# Altium project bogo_board.PrjPcb (part 4 of 4)

## Sheet 08_Programming_Reset.SchDoc: Programming/Reset/User IO
size A; Revision: A; SheetNumber: 8; SheetTotal: 10; ECE315_Project_Name: ECE453 Processor Mezzanine
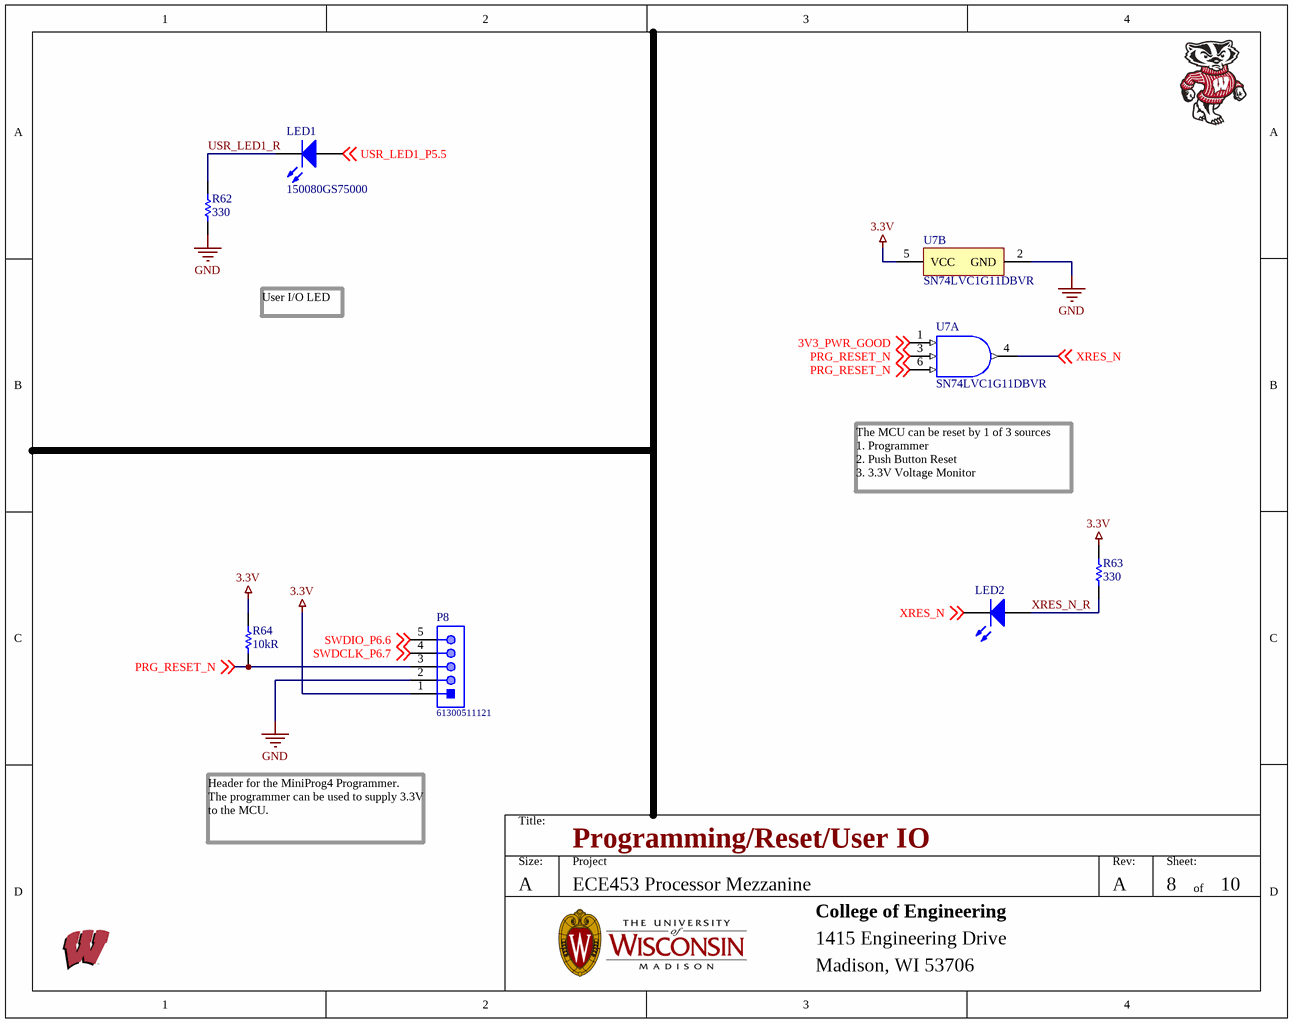
[diagram p7: 08_Programming_Reset.SchDoc]

### Parts
LED1  150080GS75000  [0805_A]
LED2  150080RS75000  [0805_A]  (value not drawn)
P8  61300511121  [61300511121]
R62  Resistance: 330  [RESC2013X60X35LL10T20]  (hidden comment: RC0805FR-07330RL)
R63  Resistance: 330  [RESC2013X60X35LL10T20]  (hidden comment: RC0805FR-07330RL)
R64  Resistance: 10kR  [RESC2013X60X35NL10T20]  (hidden comment: RC0805FR-0710KL)
U7  SN74LVC1G11DBVR  [DBV0006A_N]  (parts A,B of 2)

### Nets
3.3V: P8.1 R63.2 R64.2 U7.5(VCC)
GND: P8.2 R62.1 U7.2(GND)
3V3_PWR_GOOD: U7.1(A) ; off-sheet 3V3_PWR_GOOD
PRG_RESET_N: P8.3 R64.1 U7.3(B) U7.6(C) ; off-sheet PRG_RESET_N
SWDCLK_P6.7: P8.4 ; off-sheet SWDCLK_P6.7
SWDIO_P6.6: P8.5 ; off-sheet SWDIO_P6.6
USR_LED1_P5.5: LED1.2(A) ; off-sheet USR_LED1_P5.5
USR_LED1_R: LED1.1(K) R62.2
XRES_N: LED2.1(K) U7.4(Y) ; off-sheet XRES_N
XRES_N_R: LED2.2(A) R63.1

### Notes on the sheet
- User I/O LED
- The MCU can be reset by 1 of 3 sources
  1. Programmer
  2. Push Button Reset
  3. 3.3V Voltage Monitor
- Header for the MiniProg4 Programmer.  The programmer can be used to supply 3.3V to the MCU.
- Title:
- Size:
- A
- Project
- Rev:
- Sheet:
- of
- College of Engineering
- 1415 Engineering Drive
- Madison, WI 53706

### Library data of the parts
LED1 = CMP-1426-00007-1: SMD mono-color Chip LED, WL-SMCW, Green; Manufacturer: Wuerth Elektronik; Manufacturer 1: Wurth Electronics; Viewing Angle: 140°; Lens Style: Clear,Rectangular; Luminous Intensity: 450mcd; Forward Voltage: 3.2V; Wavelength: 520nm; Forward Current: 30mA; Test Current: 20mA; Lens Color: Colorless; Lens Transparency: Clear; Lens Size: 1.25mm; PackageReference: 0805_A; Color: Green; PartNumber: 150080GS75000; ComponentLink2URL: http://katalog.we-online.com/led/datasheet/150080GS75000.pdf; ComponentLink1URL: http://www.we-online.com; ComponentLink1Description: Manufacturer URL; ComponentLink2Description: Datasheet; Supplier 1: Digi-Key; Supplier Part Number 1: 732-4983-1-ND; Manufacturer Part Number 1: 150080GS75000; RoHS: Yes; Category: LEDs; Stock 1: 95801; Pricing 1: 1=0.19000, 50=0.17600, 100=0.15100, 500=0.13100 (USD); Mount: Surface Mount; Case/Package: 0805; Case Code (Metric): 2012; Case Code (Imperial): 0805; Min Operating Temperature: -40°C; Max Operating Temperature: 85°C; Package Quantity: 4000; Packaging: Cut Tape; Dominant Wavelength: 520nm; Length: 2mm; Width: 1.25mm; Height: 0.7mm; REACH SVHC: Unknown; RoHS Compliant: Yes; ComponentLink3URL: https://datasheet.ciiva.com/29563/150080gs75000-29563008.pdf?src-supplier=Digi-Key; ComponentLink3Description: https://datasheet.ciiva.com/29563/150080gs75000-29563008.pdf?src-supplier=Digi-Key; ComponentLink4URL: https://datasheet.ciiva.com/29279/759434-da-01-en-chipled-0805-w-kl-gruen-150080gs75000-29279039.pdf?src-supplier=Conrad; ComponentLink4Description: https://datasheet.ciiva.com/29279/759434-da-01-en-chipled-0805-w-kl-gruen-150080gs75000-29279039.pdf?src-supplier=Conrad; Supplier: Newark; Supplier Part Number: 95W3800; Manufacturer Part Number: 150080GS75000; Stock: 59977; Pricing: 1=0.194, 5=0.194, 10=0.191, 25=0.186, 50=0.18, 100=0.154, 500=0.141 (USD); Mounting Technology: Surface Mount; Series: WL-SMCW; Reach SVHC Compliant: Unknown
LED2 = CMP-1426-00011-1: SMD mono-color Chip LED, WL-SMCW, Red; Manufacturer: Wuerth Elektronik; Manufacturer 1: Wurth Electronics; Luminous Intensity: 150mcd; Viewing Angle: 140°; Forward Voltage: 2V; Lens Style: Clear,Rectangular; Forward Current: 30mA; Dominant Wavelength: 625nm; Test Current: 20mA; Lens Color: Colorless; Lens Transparency: Clear; Lens Size: 1.25mm; Color: Red; PartNumber: 150080RS75000; PackageReference: 0805_A; ComponentLink2Description: Datasheet; ComponentLink1URL: http://www.we-online.com; ComponentLink1Description: Manufacturer URL; ComponentLink2URL: http://katalog.we-online.com/led/datasheet/150080RS75000.pdf; Supplier 1: Digi-Key; Supplier Part Number 1: 732-4984-1-ND; Manufacturer Part Number 1: 150080RS75000; RoHS: Yes; Category: LEDs; Stock 1: 100282; Pricing 1: 1=0.19000, 50=0.17600, 100=0.15100, 500=0.13100 (USD); Mount: Surface Mount; Case/Package: 0805; Case Code (Metric): 2012; Case Code (Imperial): 0805; Min Operating Temperature: -40°C; Max Operating Temperature: 85°C; Packaging: Tape and Reel; Wavelength: 625nm; Package Quantity: 4000; Length: 2mm; Width: 1.25mm; Height: 0.7mm; RoHS Compliant: Yes; REACH SVHC: Unknown; ComponentLink3URL: https://datasheet.ciiva.com/22656/150080rs75000-22656961.pdf?src-supplier=Element14; ComponentLink3Description: https://datasheet.ciiva.com/22656/150080rs75000-22656961.pdf?src-supplier=Element14; ComponentLink4URL: https://datasheet.ciiva.com/29279/759435-da-01-en-chipled-0805-w-kl-rot-150080rs75000-29279032.pdf?src-supplier=Conrad; ComponentLink4Description: https://datasheet.ciiva.com/29279/759435-da-01-en-chipled-0805-w-kl-rot-150080rs75000-29279032.pdf?src-supplier=Conrad; Supplier: Newark; Supplier Part Number: 95W3801; Manufacturer Part Number: 150080RS75000; Stock: 14062; Pricing: 1=0.194, 5=0.194, 10=0.191, 25=0.186, 50=0.18, 100=0.154 (USD); Mounting Technology: Surface Mount; Series: WL-SMCW; Reach SVHC Compliant: Unknown
P8 = CMP-1502-01068-1: THT Vertical Pin Header WR-PHD, Pitch 2.54 mm, Single Row, 5 pins; Manufacturer: Wurth Elektronik; Manufacturer 1: Wurth Electronics; Pin Number: 5; Contact Resistance: 20mOhm; Working Voltage: 250VAC; Pitch: 2.54mm; Withstanding Voltage: 500VAC; Rated Current: 3A; Gender: Male; Connector Type: Male Pin; Datasheet URL: https://katalog.we-online.de/em/datasheet/6130xx11121.pdf; Orientation: Vertical; Mounting Technology: THT; Row Number: Single; Package Reference: 61300511121; Publisher: WurthElektronik; Part Number: 61300511121; Packaging: Bag; Manufacturer URL: http://www.we-online.de; Operating Temperature: -40to105degC; Supplier 1: Digi-Key; Supplier Part Number 1: 732-5318-ND; Manufacturer Part Number 1: 61300511121; RoHS: Yes; Category: Headers and Wire Housings; Stock 1: 41302; Pricing 1: 1=0.26000, 10=0.22200, 25=0.18520, 50=0.15500, 100=0.14100, 1000=0.12800 (USD); Mount: Through Hole; Contact Plating: Gold; Contact Material: Copper; Color: Black; Number of Rows: 1; Termination: Solder; Number of Contacts: 5; Number of Positions: 5; Contact Mating Length: 0.236inch; RoHS Compliant: Yes; REACH SVHC: Unknown; Lead Free: Lead Free; ComponentLink1URL: http://www.farnell.com/cad/1737268.pdf?src-supplier=Element14; ComponentLink1Description: http://www.farnell.com/cad/1737268.pdf?src-supplier=Element14; ComponentLink2URL: https://katalog.we-online.de/em/datasheet/6130xx11121.pdf?src-supplier=Digi-Key; ComponentLink2Description: https://katalog.we-online.de/em/datasheet/6130xx11121.pdf?src-supplier=Digi-Key; Supplier: Newark; Supplier Part Number: 20X0955; Manufacturer Part Number: 61300511121; Stock: 4184; Pricing: 1=0.265, 10=0.226, 25=0.189, 50=0.158, 100=0.144 (USD); Series: WR-PHD; Contact Type: Male Pin; Reach SVHC Compliant: Unknown
R62 R63 = CMP-2000-06960-1: Chip Resistor, 330 Ohm, +/- 1%, 125 mW, -55 to 155 degC, 0805 (2012 Metric), RoHS, Tape and Reel; Manufacturer: Yageo; Manufacturer Part Number: CRCW0805330RFKEA; Voltage Rating: 150V; Temperature Coefficient: 100PPM/C; Power Rating: 125mW(1/8W); Max Power Dissipation: 125mW; Value: 330R; Datasheet Version: Rev. 7, 05/2017; Termination Style: SMD/SMT; Case Code - mm: 2012; Package Description: 2-Pin Surface Mounted Device, Body 2 x 1.25 mm; Operating Temperature Range: -55Cto+155C; Case Code - in: 0805; Packaging: Reel; Tolerance: 1%; Package Reference: 0805; Mounting Technology: SurfaceMount; Product: ThickFilmResistorsGeneralPurpose; Series: RC; Manufacturer URL: http://www.yageo.com/; Datasheet URL: http://www.yageo.com/documents/recent/PYu-RC_Group_51_RoHS_L_7.pdf; Supplier 1: Digi-Key; Supplier Part Number 1: 311-330CRCT-ND; Manufacturer 1: Yageo; Manufacturer Part Number 1: RC0805FR-07330RL; RoHS: Yes; Category: Chip SMD Resistors; Stock 1: 1297787; Pricing 1: 1=0.10000, 10=0.03700, 100=0.01510, 1000=0.00680, 2500=0.00590 (USD); Case/Package: 0805; Case Code (Imperial): 0805; Case Code (Metric): 2012; Size Code: 0805; Min Operating Temperature: -55°C; Max Operating Temperature: 155°C; Package Quantity: 5000; Termination: SMD/SMT; Construction: Rectangular; Resistor Type: Thick Film; Number of Terminations: 2; Features: Moisture Resistant; Resistance Tolerance: 1%; Length: 0.079inch; Width: 0.049inch; Height: 0.024inch; Depth: 1.25mm; RoHS Compliant: Yes; Military Standard: Not; Lead Free: Lead Free; ComponentLink1URL: https://datasheet.ciiva.com/2457/pyu-r-int-thick-7-2457015.pdf?src-supplier=Digi-Key; ComponentLink1Description: https://datasheet.ciiva.com/2457/pyu-r-int-thick-7-2457015.pdf?src-supplier=Digi-Key; ComponentLink2URL: https://datasheet.ciiva.com/2457/pyu-r-int-thick-7-2457016.pdf?src-supplier=Digi-Key; ComponentLink2Description: https://datasheet.ciiva.com/2457/pyu-r-int-thick-7-2457016.pdf?src-supplier=Digi-Key; ComponentLink3URL: https://datasheet.ciiva.com/2457/pyu-r-int-thick-7-2457014.pdf?src-supplier=Digi-Key; ComponentLink3Description: https://datasheet.ciiva.com/2457/pyu-r-int-thick-7-2457014.pdf?src-supplier=Digi-Key; ComponentLink4URL: https://datasheet.ciiva.com/12667/rc0805-12667925.pdf?src-supplier=Mouser; ComponentLink4Description: https://datasheet.ciiva.com/12667/rc0805-12667925.pdf?src-supplier=Mouser; ComponentLink5URL: https://datasheet.ciiva.com/7941/444164-7941768.pdf?src-supplier=Element14; ComponentLink5Description: https://datasheet.ciiva.com/7941/444164-7941768.pdf?src-supplier=Element14; ComponentLink6URL: https://datasheet.ciiva.com/7941/444164-7941769.pdf?src-supplier=Element14; ComponentLink6Description: https://datasheet.ciiva.com/7941/444164-7941769.pdf?src-supplier=Element14; ComponentLink7URL: https://datasheet.ciiva.com/16740/rc0805-16740975.pdf?src-supplier=Future+Electronics; ComponentLink7Description: https://datasheet.ciiva.com/16740/rc0805-16740975.pdf?src-supplier=Future+Electronics; Supplier: Newark; Supplier Part Number: 53K0164; Stock: 218356; Pricing: 1=0.02, 25=0.02, 50=0.02, 100=0.02 (USD); Contact Plating: Tin; Weight: 0.000194oz; Voltage Rating (DC): 150V; Ratings: AEC-Q200; Reach SVHC Compliant: Unknown; ComponentLink8URL: https://datasheet.ciiva.com/8944/dcrcwe3-8944773.pdf?src-supplier=Avnet; ComponentLink8Description: https://datasheet.ciiva.com/8944/dcrcwe3-8944773.pdf?src-supplier=Avnet; ComponentLink9URL: https://datasheet.ciiva.com/8944/dcrcwe3-8944776.pdf?src-supplier=Avnet; ComponentLink9Description: https://datasheet.ciiva.com/8944/dcrcwe3-8944776.pdf?src-supplier=Avnet; ComponentLink10URL: https://datasheet.ciiva.com/7777/1697337-7777390.pdf?src-supplier=Element14; ComponentLink10Description: https://datasheet.ciiva.com/7777/1697337-7777390.pdf?src-supplier=Element14; ComponentLink11URL: https://datasheet.ciiva.com/16769/70201119-16769852.pdf?src-supplier=Allied+Electronics; ComponentLink11Description: https://datasheet.ciiva.com/16769/70201119-16769852.pdf?src-supplier=Allied+Electronics
R64 = CMP-1659-00013-4: Chip Resistor, 10 KOhm, +/- 1%, 0.125 W, -55 to 155 degC, 0805 (2012 Metric), RoHS, Tape and Reel; Manufacturer: Yageo; Voltage Rating: 150 V; Temperature Coefficient: 100ppm/°C; Power Rating: 125mW; Value: 10kR; Mount: Surface Mount; ComponentLink1Description: Manufacturer URL; ComponentLink2URL: http://www.yageo.com/documents/recent/PYu-RC_Group_51_RoHS_L_04.pdf; Pins: 2; Length: 2 mm; Min Operating Temperature: -55 degC; Height: 0.5 mm; Mounting Technology: Surface Mount; RoHSCompliant: true; REACH SVHC: No SVHC; ComponentLink1URL: http://www.yageo.com/; Max Operating Temperature: 155 degC; PackageReference: 0805; DatasheetVersion: Rev. 4, 02/2016; Package Quantity: 5000; Packaging: Tape and Reel; ComponentLink2Description: Datasheet; PackageDescription: 2-Pin Surface Mounted Device, Body 2 x 1.25 mm; Supplier 1: Digi-Key; Supplier Part Number 1: 311-10.0KCRCT-ND; Manufacturer 1: Yageo; Manufacturer Part Number 1: RC0805FR-0710KL; RoHS: Yes; Category: Chip SMD Resistors; Stock 1: 5682818; Pricing 1: 1=0.10000, 10=0.03800, 100=0.01560, 1000=0.00702, 2500=0.00610 (USD); Case/Package: 0805; Case Code (Imperial): 0805; Case Code (Metric): 2012; Size Code: 0805; Tolerance: 1%; Resistor Type: Thick Film; Series: RC; Number of Terminations: 2; Max Power Dissipation: 125mW; Termination: SMD/SMT; Features: Moisture Resistant; Construction: Rectangular; Resistance Tolerance: 1%; Technology: THICK FILM; Width: 0.049inch; Depth: 1.25mm; RoHS Compliant: Yes; Military Standard: Not; Lead Free: Lead Free; ComponentLink3URL: https://datasheet.ciiva.com/11808/0900766b8106beab-11808151.pdf?src-supplier=RSComponents; ComponentLink3Description: https://datasheet.ciiva.com/11808/0900766b8106beab-11808151.pdf?src-supplier=RSComponents; ComponentLink4URL: https://datasheet.ciiva.com/46447/444164-46447563.pdf?src-supplier=Element14; ComponentLink4Description: https://datasheet.ciiva.com/46447/444164-46447563.pdf?src-supplier=Element14; ComponentLink5URL: https://datasheet.ciiva.com/2456/pyu-r-int-thick-7-2456973.pdf?src-supplier=Digi-Key; ComponentLink5Description: https://datasheet.ciiva.com/2456/pyu-r-int-thick-7-2456973.pdf?src-supplier=Digi-Key; ComponentLink6URL: https://datasheet.ciiva.com/2456/pyu-r-int-thick-7-2456974.pdf?src-supplier=Digi-Key; ComponentLink6Description: https://datasheet.ciiva.com/2456/pyu-r-int-thick-7-2456974.pdf?src-supplier=Digi-Key; ComponentLink7URL: https://datasheet.ciiva.com/2456/pyu-r-int-thick-7-2456972.pdf?src-supplier=Digi-Key; ComponentLink7Description: https://datasheet.ciiva.com/2456/pyu-r-int-thick-7-2456972.pdf?src-supplier=Digi-Key; ComponentLink8URL: https://datasheet.ciiva.com/12669/rc0805-12669688.pdf?src-supplier=Mouser; ComponentLink8Description: https://datasheet.ciiva.com/12669/rc0805-12669688.pdf?src-supplier=Mouser; ComponentLink9URL: https://datasheet.ciiva.com/16747/rc0805-16747087.pdf?src-supplier=Future+Electronics; ComponentLink9Description: https://datasheet.ciiva.com/16747/rc0805-16747087.pdf?src-supplier=Future+Electronics; Supplier: Newark; Supplier Part Number: 05M4535; Manufacturer Part Number: RC0805FR-0710KL; Stock: 346650; Pricing: 1=0.102, 10=0.035, 25=0.028, 50=0.021, 100=0.014 (USD); Reach SVHC Compliant: Unknown; ComponentLink10URL: https://datasheet.ciiva.com/11808/0900766b8106beab-11808151.pdf?src-supplier=Rs; ComponentLink10Description: https://datasheet.ciiva.com/11808/0900766b8106beab-11808151.pdf?src-supplier=Rs
U7 = CMP-0859-00236-3: Single 3-Input Positive-AND Gate, DBV0006A, LARGE T&R; Manufacturer: Texas Instruments; Output Type: CMOS; Voltage(Nom)(V): 1.8,2.5,3.3,5; ICC @ Nom Voltage(Max)(mA): 0.01; VCC(Min)(V): 1.65; Output Drive (IOL/IOH)(Max)(mA): 32/-32; Schmitt Trigger: No; Input Type: CMOS/TTL; VCC(Max)(V): 5.5; Gate Type: AND; Rating: Catalog; tpd @ Nom Voltage(Max)(ns): 20,7.8,6.2,4.6; Bits(#): 1; F @ Nom Voltage(Max)(Mhz): 150; Logic: True; Technology Family: LVC; Number of Inputs: 3; Propagation Delay: 3.5ns; Min Supply Voltage: 1.65V; Max Supply Voltage: 5.5V; Quiescent Current: 10uA; High Level Output Current: -32mA; Low Level Output Current: 32mA; Turn-On Delay Time: 4.9ns; Sub-Family: AND Gate; PackageReference: DBV0006A; Operating Temperature Range(C): -40 to 125,-40 to 85; DatasheetVersion: SCES487F; 3-State Output: No; Generic Part Number: SN74LVC1G11; Supplier: Newark; Supplier Part Number: 29AH7598; Manufacturer Part Number: SN74LVC1G11DBVR; RoHS: Yes; Category: Logic Gates; Pricing: 1=0.398, 5=0.398, 10=0.326, 25=0.298, 50=0.26, 100=0.221, 250=0.211, 500=0.206, 1000=0.203 (USD); Mounting Technology: Surface Mount; Case/Package: SOT-23; Pins: 6; Weight: 0.000229oz; Min Operating Temperature: -40°C; Max Operating Temperature: 125°C; Packaging: Tape and Reel; Logic Function: AND GATE; Number of Outputs: 1; Number of Elements: 1; Number of Circuits: 1; Number of Input Lines: 3; Number of Output Lines: 1; Number of Bits: 1; Series: 74LVC; Technology: CMOS; Number of Gates: 1; Termination: SMD/SMT; Max Output current: 32mA; Output Current: 32mA; Radiation Hardening: No; Lead Free: Lead Free; RoHS Compliant: Yes; Reach SVHC Compliant: No; ComponentLink1URL: https://datasheet.ciiva.com/1864/sn74lvc1g11-1864480.pdf?src-supplier=Digi-Key; ComponentLink1Description: https://datasheet.ciiva.com/1864/sn74lvc1g11-1864480.pdf?src-supplier=Digi-Key; ComponentLink2URL: https://datasheet.ciiva.com/6124/1775276-6124474.pdf?src-supplier=Farnell; ComponentLink2Description: https://datasheet.ciiva.com/6124/1775276-6124474.pdf?src-supplier=Farnell; ComponentLink3URL: https://datasheet.ciiva.com/1864/sn74lvc1g11-1864479.pdf?src-supplier=Digi-Key; ComponentLink3Description: https://datasheet.ciiva.com/1864/sn74lvc1g11-1864479.pdf?src-supplier=Digi-Key; ComponentLink4URL: https://datasheet.ciiva.com/1864/sn74lvc1g11-1864481.pdf?src-supplier=Digi-Key; ComponentLink4Description: https://datasheet.ciiva.com/1864/sn74lvc1g11-1864481.pdf?src-supplier=Digi-Key; ComponentLink5URL: https://datasheet.ciiva.com/14290/sn74lvc1g11-14290741.pdf?src-supplier=Avnet; ComponentLink5Description: https://datasheet.ciiva.com/14290/sn74lvc1g11-14290741.pdf?src-supplier=Avnet; ComponentLink6URL: https://datasheet.ciiva.com/46384/1882071-46384382.pdf?src-supplier=Element14; ComponentLink6Description: https://datasheet.ciiva.com/46384/1882071-46384382.pdf?src-supplier=Element14; ComponentLink7URL: https://datasheet.ciiva.com/7783/1775276-7783594.pdf?src-supplier=Element14; ComponentLink7Description: https://datasheet.ciiva.com/7783/1775276-7783594.pdf?src-supplier=Element14; ComponentLink8URL: https://datasheet.ciiva.com/7783/1775276-7783595.pdf?src-supplier=Element14; ComponentLink8Description: https://datasheet.ciiva.com/7783/1775276-7783595.pdf?src-supplier=Element14

## Sheet 06_Servo_Motor_ICs.SchDoc: Servo Motor ICs
size A; Revision: A; SheetNumber: 6; SheetTotal: 10; ECE315_Project_Name: ECE453 F23 Base Project
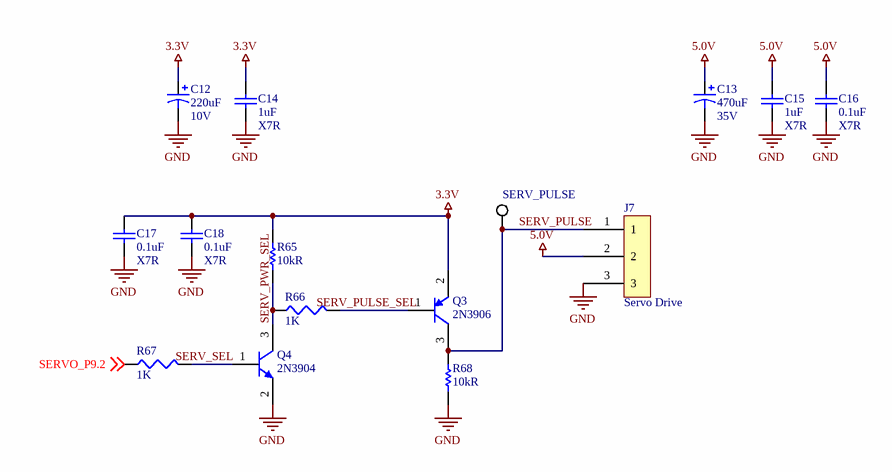
[diagram p8: 06_Servo_Motor_ICs.SchDoc]

### Parts
C12  Voltage: 10V  [CAPPR2-5x11]  (hidden comment: 220uF)
C13  Voltage: 35V  [CAPPR5-10x12.5]  (hidden comment: 470uF)
C14  Dielectric: X7R  [CAP_0805]  (hidden comment: 1uF)
C15  Dielectric: X7R  [CAP_0805]  (hidden comment: 1uF)
C16  Dielectric: X7R  [CAP_0805]  (hidden comment: 0.1uF)
C17  Dielectric: X7R  [CAP_0805]  (hidden comment: 0.1uF)
C18  Dielectric: X7R  [CAP_0805]  (hidden comment: 0.1uF)
J7  Servo Drive  [3X1HDR]
Q3  2N3906  [SOT23-3M]
Q4  2N3904  [SOT23-3M]
R65  Resistance: 10kR  [RESC2013X60X35NL10T20]  (hidden comment: RC0805FR-0710KL)
R66  value 1K  [RES_0805]  (hidden comment: 10K)
R67  value 1K  [RES_0805]  (hidden comment: 10K)
R68  Resistance: 10kR  [RESC2013X60X35NL10T20]  (hidden comment: RC0805FR-0710KL)
SERV_PULSE  (no value)  [KSTN-5019_V]

### Nets
3.3V: C12.1 C14.2 C17.1 C18.2 Q3.2(E) R65.2
5.0V: C13.1 C15.2 C16.2 J7.2
GND: C12.2 C13.2 C14.1 C15.1 C16.1 C17.2 C18.1 J7.3 Q4.2(E) R68.1
SERV_PULSE: J7.1 Q3.3(C) R68.2 SERV_PULSE.1
SERV_PULSE_SEL: Q3.1(B) R66.2
SERV_PWR_SEL: Q4.3(C) R65.1 R66.1
SERV_SEL: Q4.1(B) R67.2
SERVO_P9.2: R67.1 ; off-sheet SERVO_P9.2

### Notes on the sheet
- Title:
- Size:
- A
- Project
- Rev:
- Sheet:
- of
- College of Engineering
- 1415 Engineering Drive
- Madison, WI 53706

### Library data of the parts
C12 = Cap Pol1_1: Capacitor Al 105deg 220uF 10V 5X11; Manufacturer: Rubycon; Manufacturer Part Number: 10YXJ220M5X11; Tolerance: 20%; Ripple Current: 250mA; Impedance: 400mR; Leakage Current: 3uA; Life (Hours): 4000Hour; Lead Diameter: 0.5mm; Value: 220uF; Supplier: Digi-Key; Supplier Part Number: 1189-4150-ND; RoHS: Yes; Category: Aluminum Electrolytic Capacitors; Stock 1: 94; Pricing 1: 1=0.26000, 10=0.17500, 50=0.11680, 100=0.09930, 500=0.07010, 1000=0.06134, 2500=0.05842, 5000=0.05404 (USD); Mount: Through Hole; Case/Package: Radial; Min Operating Temperature: -40°C; Max Operating Temperature: 105°C; Capacitance: 220uF; Termination: Radial; Package Quantity: 3000; Packaging: Bulk; Voltage Rating: 10V; Series: YXJ; Construction: RADIAL; Diameter: 5mm; Height: 11mm; Lead Pitch: 2mm; Height - Seated (Max): 0.492inch; Radiation Hardening: No; RoHS Compliant: Yes; ComponentLink1URL: https://datasheet.ciiva.com/11777/0900766b810307a1-11777018.pdf?src-supplier=RSComponents; ComponentLink1Description: https://datasheet.ciiva.com/11777/0900766b810307a1-11777018.pdf?src-supplier=RSComponents; ComponentLink2URL: https://datasheet.ciiva.com/6318/e-yxj-6318863.pdf?src-supplier=Digi-Key; ComponentLink2Description: https://datasheet.ciiva.com/6318/e-yxj-6318863.pdf?src-supplier=Digi-Key; ComponentLink3URL: https://datasheet.ciiva.com/11690/e-yxj-11690699.pdf?src-supplier=Avnet; ComponentLink3Description: https://datasheet.ciiva.com/11690/e-yxj-11690699.pdf?src-supplier=Avnet
C13 = Cap Pol3_1: CAP ALUM 470UF 20% 35V RADIAL; Manufacturer: Rubycon; Manufacturer Part Number: 35ZL470MEFC10X20; Leakage Current: 3uA; Lead Diameter: 0.6mm; Dielectric Material: Aluminium; Life (Hours): 4000Hour; Ripple Current: 1.82A; Impedance: 23mR; Value: 470uF; Case/Package: Radial; Max Operating Temperature: 105°C; REACH SVHC: Unknown; Min Operating Temperature: -40°C; Supplier Part Number: 35ZL470MEFC10X20-ND; Packaging: Bulk; Lead Pitch: 5mm; Diameter: 10mm; Capacitance: 470uF; Lead Free: Lead Free; Radiation Hardening: No; Package Quantity: 1000; Height: 20mm; Voltage Rating: 35V; Mount: Through Hole; Supplier: Digi-Key; Height - Seated (Max): 0.866inch; Tolerance: 20%; Termination: Radial
C14 C15 = Cap_5: CAP CER 1UF 50V X7R 0805; Manufacturer: Samsung; Manufacturer Part Number: CL21B105KBFNNNE; Tolerance: 10%; Dielectric Material: Ceramic; Value: 1uF; Case Code (Metric): 2012; Min Operating Temperature: -55°C; Mount: Surface Mount; Width: 0.049inch; Voltage Rating (DC): 50V; Voltage Rating: 50V; Height: 1.25mm; Case Code (Imperial): 0805; Supplier: Digi-Key; Supplier Part Number: 1276-1029-6-ND; Capacitance: 1uF; Case/Package: 0805; Construction: Flat; Max Operating Temperature: 125°C; REACH SVHC: No SVHC; Voltage: 50V; Packaging: Tape and Reel; Depth: 1.25mm; Package Quantity: 1; Radiation Hardening: No; Series: CL; Length: 2mm; Thickness: 0.053inch; Termination: SMD/SMT; Number of Pins: 2; RoHS Compliant: Yes
C16-C18 = Cap_1: Cap Ceramic 0.1uF 50V X7R 20% SMD 0805 125°C Plastic T/R; Manufacturer: KEMET; Manufacturer Part Number: C0805C104M5RAC7210; Supplier: Digi-Key; Supplier Part Number: 399-C0805C104M5RAC7210CT-ND; RoHS: Yes; Category: Ceramic Capacitors; Stock 1: 29705; Pricing 1: 1=0.10000, 10=0.05900, 50=0.03220, 100=0.02620, 500=0.01874, 1000=0.01472, 2500=0.01338, 5000=0.01231 (USD); Mounting Technology: Surface Mount; Case/Package: 0805; Dielectric Material: Ceramic; Min Operating Temperature: -55°C; Max Operating Temperature: 125°C; Packaging: Tape and Reel; Tolerance: 20%; Voltage Rating (DC): 50V; Construction: Flat; Length: 2mm; Height: 0.9mm; Depth: 1.25mm; Radiation Hardening: No; RoHS Compliant: Yes; ComponentLink1URL: https://datasheet.ciiva.com/26923/getdatasheetpartid-738954-26923963.pdf?src-supplier=Verical; ComponentLink1Description: https://datasheet.ciiva.com/26923/getdatasheetpartid-738954-26923963.pdf?src-supplier=Verical; Value: 0.1uF
J7 = 3-Pin_1: Switch Slide N.O./N.C. SPDT Top Slide 0.2A 30VDC PC Pins Thru-Hole; Manufacturer: E-Switch; Manufacturer Part Number: EG1218; Voltage Rating (DC): 30V; Electrical Life: 10000Cycles; Switch Travel: 2.5mm; Switch Function: On-On; Actuator Type: Standard; Contact Current Rating: 200mA; Operating Force: 250gf; Illumination Type: Non-Illuminated; Number of Positions: 2; Insulation Resistance: 100R; Contact Resistance: 20mR; Actuator Length: 2mm; Supplier 1: Digi-Key; Supplier Part Number 1: EG1903-ND; RoHS: Yes; Category: Slide Switches; Stock 1: 46638; Pricing 1: 1=0.74, 25=0.6664, 100=0.5958, 500=0.5047, 2500=0.42434 (USD); Mounting Technology: Through Hole; Pins: 3; Contact Material: Copper Alloy,Copper,Silver; Contact Plating: Silver; Min Operating Temperature: -20°C; Max Operating Temperature: 70°C; Throw Configuration: SPDT; Termination: PC Pin; Packaging: Bulk; Orientation: Straight; Series: EG; Voltage Rating (AC): 30V; Voltage Rating: 30V; Lead Free: Lead Free; RoHS Compliant: Yes; Reach SVHC Compliant: No; ComponentLink1URL: https://datasheet.ciiva.com/1699/p040040c-1699451.pdf?src-supplier=Newark; ComponentLink1Description: https://datasheet.ciiva.com/1699/p040040c-1699451.pdf?src-supplier=Newark
Q3 = 2N3906: TRANS PNP 40V 0.2A SOT23; Manufacturer Part Number: MMBT3906LT1G; Manufacturer: ON Semiconductor; Current - Collector (Ic) (Max): 200mA; Vce Saturation (Max) @ Ib, Ic: 400mV @ 5mA, 50mA; DC Current Gain (hFE) (Min) @ Ic, Vce: 100 @ 10mA, 1V; Power - Max: 300mW; Frequency - Transition: 250MHz; Transistor Type: PNP; Category: Discrete Semiconductor Products; RoHS: RoHS Compliant; Supplier: Digi-Key; Supplier Part Number: MMBT3906LT1GOSCT-ND; Packaging: Cut Tape (CT); Voltage - Collector Emitter Breakdown (Max): 40V; Mounting Type: Surface Mount; Supplier Device Package: SOT-23-3 (TO-236); Package / Case: TO-236-3, SC-59, SOT-23-3; Value: 2N3906
Q4 = 2N3904: NPN General Purpose Amplifier; Manufacturer Part Number: MMBT3904-7-F; Manufacturer: Diodes Incorporated; Frequency - Transition: 300MHz; Power - Max: 300mW; DC Current Gain (hFE) (Min) @ Ic, Vce: 100 @ 10mA, 1V; Current - Collector Cutoff (Max): 50nA (ICBO); Vce Saturation (Max) @ Ib, Ic: 300mV @ 5mA, 50mA; Voltage - Collector Emitter Breakdown (Max): 40V; Current - Collector (Ic) (Max): 200mA; Supplier Device Package: SOT-23-3; Mounting Type: Surface Mount; Transistor Type: NPN; Packaging: Cut Tape (CT); RoHS: RoHS Compliant; Package / Case: TO-236-3, SC-59, SOT-23-3; Supplier Part Number: MMBT3904-FDICT-ND; Supplier: Digi-Key; Category: Discrete Semiconductor Products; Value: 2N3904
R65 R68 = CMP-1659-00013-4: as R64 on sheet 08_Programming_Reset; Mount: Surface Mount; ComponentLink1Description: Manufacturer URL; ComponentLink2URL: http://www.yageo.com/documents/recent/PYu-RC_Group_51_RoHS_L_04.pdf; Pins: 2; Length: 2 mm; Min Operating Temperature: -55 degC; Height: 0.5 mm; Mounting Technology: Surface Mount; RoHSCompliant: true; REACH SVHC: No SVHC; ComponentLink1URL: http://www.yageo.com/; Max Operating Temperature: 155 degC; PackageReference: 0805; DatasheetVersion: Rev. 4, 02/2016; Package Quantity: 5000; Packaging: Tape and Reel; ComponentLink2Description: Datasheet; PackageDescription: 2-Pin Surface Mounted Device, Body 2 x 1.25 mm; Supplier 1: Digi-Key; Supplier Part Number 1: 311-10.0KCRCT-ND; Manufacturer 1: Yageo; Manufacturer Part Number 1: RC0805FR-0710KL; RoHS: Yes; Category: Chip SMD Resistors; Stock 1: 5682818; Pricing 1: 1=0.10000, 10=0.03800, 100=0.01560, 1000=0.00702, 2500=0.00610 (USD); Case/Package: 0805; Case Code (Imperial): 0805; Case Code (Metric): 2012; Size Code: 0805; Tolerance: 1%; Resistor Type: Thick Film; Series: RC; Number of Terminations: 2; Max Power Dissipation: 125mW; Termination: SMD/SMT; Features: Moisture Resistant; Construction: Rectangular; Resistance Tolerance: 1%; Technology: THICK FILM; Width: 0.049inch; Depth: 1.25mm; RoHS Compliant: Yes; Military Standard: Not; Lead Free: Lead Free; ComponentLink3URL: https://datasheet.ciiva.com/11808/0900766b8106beab-11808151.pdf?src-supplier=RSComponents; ComponentLink3Description: https://datasheet.ciiva.com/11808/0900766b8106beab-11808151.pdf?src-supplier=RSComponents; ComponentLink4URL: https://datasheet.ciiva.com/46447/444164-46447563.pdf?src-supplier=Element14; ComponentLink4Description: https://datasheet.ciiva.com/46447/444164-46447563.pdf?src-supplier=Element14; ComponentLink5URL: https://datasheet.ciiva.com/2456/pyu-r-int-thick-7-2456973.pdf?src-supplier=Digi-Key; ComponentLink5Description: https://datasheet.ciiva.com/2456/pyu-r-int-thick-7-2456973.pdf?src-supplier=Digi-Key; ComponentLink6URL: https://datasheet.ciiva.com/2456/pyu-r-int-thick-7-2456974.pdf?src-supplier=Digi-Key; ComponentLink6Description: https://datasheet.ciiva.com/2456/pyu-r-int-thick-7-2456974.pdf?src-supplier=Digi-Key; ComponentLink7URL: https://datasheet.ciiva.com/2456/pyu-r-int-thick-7-2456972.pdf?src-supplier=Digi-Key; ComponentLink7Description: https://datasheet.ciiva.com/2456/pyu-r-int-thick-7-2456972.pdf?src-supplier=Digi-Key; ComponentLink8URL: https://datasheet.ciiva.com/12669/rc0805-12669688.pdf?src-supplier=Mouser; ComponentLink8Description: https://datasheet.ciiva.com/12669/rc0805-12669688.pdf?src-supplier=Mouser; ComponentLink9URL: https://datasheet.ciiva.com/16747/rc0805-16747087.pdf?src-supplier=Future+Electronics; ComponentLink9Description: https://datasheet.ciiva.com/16747/rc0805-16747087.pdf?src-supplier=Future+Electronics; Supplier: Newark; Supplier Part Number: 05M4535; Manufacturer Part Number: RC0805FR-0710KL; Stock: 346650; Pricing: 1=0.102, 10=0.035, 25=0.028, 50=0.021, 100=0.014 (USD); Reach SVHC Compliant: Unknown; ComponentLink10URL: https://datasheet.ciiva.com/11808/0900766b8106beab-11808151.pdf?src-supplier=Rs; ComponentLink10Description: https://datasheet.ciiva.com/11808/0900766b8106beab-11808151.pdf?src-supplier=Rs
R66 R67 = Res3_1: Res Thick Film 0805 1K Ohm 1% 0.125W(1/8W) ±100ppm/C Pad SMD Automotive T/R; Manufacturer: Stackpole Electronics; Manufacturer Part Number: RMCF0805FT1K00; Power Rating: 125mW; Temperature Coefficient: 100ppm/°C; Supplier 1: Digi-Key; Supplier Part Number 1: RMCF0805FT1K00CT-ND; RoHS: Yes; Category: Chip SMD Resistors; Stock 1: 2773085; Pricing 1: 1=0.10000, 10=0.02400, 100=0.00970, 1000=0.00437, 2500=0.00379 (USD); Mounting Technology: Surface Mount; Case/Package: 0805; Case Code (Metric): 2012; Case Code (Imperial): 0805; Contact Plating: Tin,Matte; Min Operating Temperature: -55°C; Max Operating Temperature: 155°C; Tolerance: 1%; Packaging: Tape and Reel; Resistor Type: Thick Film; Number of Terminations: 2; Max Power Dissipation: 125mW; Features: Automotive AEC-Q200; Series: RMCF; Construction: Rectangular; Length: 2mm; Width: 0.049inch; Height: 0.026inch; Depth: 1.25mm; Radiation Hardening: No; Military Standard: Not; Lead Free: Lead Free; RoHS Compliant: Yes; ComponentLink1URL: https://datasheet.ciiva.com/15193/getdatasheetpartid-360136-15193546.pdf?src-supplier=Verical; ComponentLink1Description: https://datasheet.ciiva.com/15193/getdatasheetpartid-360136-15193546.pdf?src-supplier=Verical
SERV_PULSE = CMP-1672-00008-1: Test Point, 1 Position SMD, RoHS, Tape and Reel; Manufacturer: Keystone Electronics; Manufacturer Part Number: 5019; Plating: Silver; Body Material: Bronze; Supplier: Newark; Supplier Part Number: 59Y8500; RoHS: Yes; Category: Connectors; Stock: 11269; Pricing: 1=0.411, 10=0.389, 25=0.285, 50=0.279, 100=0.273, 250=0.246 (USD); Mounting Technology: Surface Mount,PCB; Pins: 1; Contact Plating: Silver; Contact Material: Bronze; Material: Bronze; Packaging: Tape and Reel; Package Quantity: 1; Termination: SMD/SMT; Series: 5019; Height: 0.09inch; Reach SVHC Compliant: No; RoHS Compliant: Yes; Lead Free: Lead Free; ComponentLink1URL: https://datasheet.ciiva.com/14848/m60-2p61-14848437.pdf?src-supplier=Digi-Key; ComponentLink1Description: https://datasheet.ciiva.com/14848/m60-2p61-14848437.pdf?src-supplier=Digi-Key; ComponentLink2URL: https://datasheet.ciiva.com/14848/m60-2p61-14848438.pdf?src-supplier=Digi-Key; ComponentLink2Description: https://datasheet.ciiva.com/14848/m60-2p61-14848438.pdf?src-supplier=Digi-Key; ComponentLink3URL: https://datasheet.ciiva.com/14848/m60-2p61-14848439.pdf?src-supplier=Digi-Key; ComponentLink3Description: https://datasheet.ciiva.com/14848/m60-2p61-14848439.pdf?src-supplier=Digi-Key; ComponentLink4URL: https://datasheet.ciiva.com/16318/m60-2p61-16318395.pdf?src-supplier=Future+Electronics; ComponentLink4Description: https://datasheet.ciiva.com/16318/m60-2p61-16318395.pdf?src-supplier=Future+Electronics; ComponentLink5URL: https://datasheet.ciiva.com/16885/70182998-16885945.pdf?src-supplier=Allied+Electronics; ComponentLink5Description: https://datasheet.ciiva.com/16885/70182998-16885945.pdf?src-supplier=Allied+Electronics

## Sheet 09_USB_Bridge.SchDoc: USB Bridge
size A; Revision: A; SheetNumber: 9; SheetTotal: 10; ECE315_Project_Name: ECE453 Processor Mezzanine
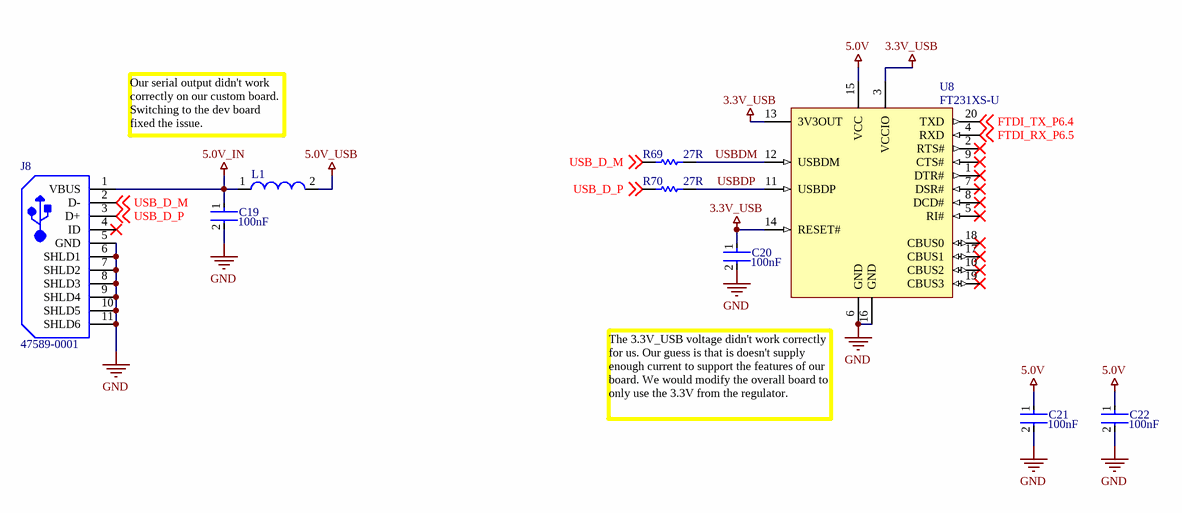
[diagram p9: 09_USB_Bridge.SchDoc]

### Parts
C19  value 100nF  [FP-C0805C-DN-MFG]  (hidden comment: C0805C104K5RACTU)
C20  value 100nF  [FP-C0805C-DN-MFG]  (hidden comment: C0805C104K5RACTU)
C21  value 100nF  [FP-C0805C-DN-MFG]  (hidden comment: C0805C104K5RACTU)
C22  value 100nF  [FP-C0805C-DN-MFG]  (hidden comment: C0805C104K5RACTU)
J8  47589-0001  [MOLX-47589-0001_V]
L1  742792093  [SMD-0805]  (value not drawn)
R69  value 27R  [RESC2013X70X40ML20T20]  (hidden comment: ERJ6ENF27R0V)
R70  value 27R  [RESC2013X70X40ML20T20]  (hidden comment: ERJ6ENF27R0V)
U8  FT231XS-U  [SSOP-20_L]

### Nets
3.3V_USB: C20.1 U8.3(VCCIO) U8.13(3V3OUT) U8.14(RESET#)
5.0V: C21.1 C22.1 U8.15(VCC)
5.0V_IN: C19.1 J8.1(VBUS) L1.1
5.0V_USB: L1.2
GND: C19.2 C20.2 C21.2 C22.2 J8.5(GND) J8.6(SHLD1) J8.7(SHLD2) J8.8(SHLD3) J8.9(SHLD4) J8.10(SHLD5) J8.11(SHLD6) U8.6(GND) U8.16(GND)
FTDI_RX_P6.5: U8.4(RXD) ; off-sheet FTDI_RX_P6.5
FTDI_TX_P6.4: U8.20(TXD) ; off-sheet FTDI_TX_P6.4
USB_D_M: J8.2(D-) R69.1 ; off-sheet USB_D_M
USB_D_P: J8.3(D+) R70.1 ; off-sheet USB_D_P
USBDM: R69.2 U8.12(USBDM)
USBDP: R70.2 U8.11(USBDP)

Not connected (* = marked no-connect by the designer): J8 4(ID)*; U8 1(DTR#)* 2(RTS#)* 5(RI#)* 7(DSR#)* 8(DCD#)* 9(CTS#)* 10(CBUS2)* 17(CBUS1)* 18(CBUS0)* 19(CBUS3)*

### Notes on the sheet
- Our serial output didn't work correctly on our custom board. Switching to the dev board fixed the issue.
- (near U8) The 3.3V_USB voltage didn't work correctly for us. Our guess is that is doesn't supply enough current to support the features of our board. We would modify the overall board to only use the 3.3V from the regulator.
- Title:
- Size:
- A
- Project
- Rev:
- Sheet:
- of
- College of Engineering
- 1415 Engineering Drive
- Madison, WI 53706

### Library data of the parts
C19-C22 = CMP-2007-00279-2: CAP CER 0.1UF 50V X7R 0805; Manufacturer: KEMET; Tolerance: 10%; Voltage: 500V; ComponentLink2Description: Datasheet; ComponentLink2URL: https://content.kemet.com/datasheets/KEM_C1003_C0G_SMD.pdf; Supplier: Newark; Supplier Part Number: 19C6015; Manufacturer Part Number: C0805C104K5RACTU; RoHS: Yes; Category: Ceramic Capacitors; Stock: 3382390; Pricing: 1=0.024, 25=0.024, 50=0.024, 100=0.024, 250=0.024, 500=0.024, 1000=0.024 (USD); Mounting Technology: Surface Mount,PCB; Case/Package: 0805; Pins: 2; Case Code (Imperial): 0805; Case Code (Metric): 2012; Min Operating Temperature: -55°C; Max Operating Temperature: 125°C; Package Quantity: 4000; Voltage Rating: 50V; Packaging: Tape and Reel; Voltage Rating (DC): 50V; Dielectric: X7R; Termination: SMD/SMT; Series: SMD Comm X7R; Construction: Flat; Length: 2mm; Width: 1.2mm; Height: 0.9mm; Lead Pitch: 0.75mm; Depth: 1.25mm; Radiation Hardening: No; RoHS Compliant: Yes; Reach SVHC Compliant: No; ComponentLink1URL: https://datasheet.ciiva.com/32431/slceramic-chip-condensers-e-32431755.pdf?src-supplier=Distrelec; ComponentLink1Description: https://datasheet.ciiva.com/32431/slceramic-chip-condensers-e-32431755.pdf?src-supplier=Distrelec; ComponentLink3URL: https://datasheet.ciiva.com/28682/1851736-28682232.pdf?src-supplier=Element14; ComponentLink3Description: https://datasheet.ciiva.com/28682/1851736-28682232.pdf?src-supplier=Element14
J8 = CMP-2000-05610-1: Right Angle Female Type AB Micro USB Connector, 30 V, 1.8 A, -30 to 85 degC, RoHS, Tape and Reel; Manufacturer: Molex; Voltage Rating: 30V; Contact Resistance: 40mR; Current Rating: 1.8A; Max Voltage Rating (AC): 100V; Connector Type: USB,Receptacle; Number of Ports: 1; Number of Contacts: 5; USB Standard: USB 2.0; Pitch: 0.65mm; Supplier: Newark; Supplier Part Number: 40P3749; Manufacturer Part Number: 47589-0001; RoHS: Yes; Category: USB Connectors; Stock: 10404; Pricing: 1=0.536, 25=0.536, 100=0.492, 250=0.492, 500=0.492, 1000=0.492 (USD); Mounting Technology: Surface Mount,PCB; Contact Plating: Gold; Contact Material: Copper Alloy,Copper; Color: Black; Housing Material: Polymer; Min Operating Temperature: -20°C; Max Operating Temperature: 85°C; Packaging: Tape and Reel; Termination: Solder; Series: 47589; Voltage Rating (AC): 30V; Gender: Female; Orientation: Right Angle; Length: 8.65mm; Radiation Hardening: No; RoHS Compliant: Yes; Reach SVHC Compliant: Unknown; ComponentLink1URL: https://datasheet.ciiva.com/1098/1597783-1098478.pdf?src-supplier=Element14; ComponentLink1Description: https://datasheet.ciiva.com/1098/1597783-1098478.pdf?src-supplier=Element14; ComponentLink2URL: https://datasheet.ciiva.com/11731/0900766b80dfe0a8-11731295.pdf?src-supplier=Rs; ComponentLink2Description: https://datasheet.ciiva.com/11731/0900766b80dfe0a8-11731295.pdf?src-supplier=Rs
L1 = CMP-0220-00169-1: SMD EMI Suppression Ferrite Bead WE-CBF, Z = 2200 Ohm; Manufacturer: Wurth Electronics; Current Rating: 200mA; Tolerance: 25%; Number of Lines: 1; DC Resistance (DCR): 600mR; Test Frequency: 100MHz; Value: 3.9nH; Shielding: Unshielded; DatasheetVersion: Dec-2005; ComponentLink2URL: http://www.we-online.de/katalog/media/pdf/742792093.pdf; PackageDescription: Chip Inductor, 2-Leads, Body 2.0 x 1.2 mm; Impedance: 2200 Ohm; ComponentLink2Description: Datasheet; ComponentLink1Description: Manufacturer Link; PackageReference: SMD-0805; ComponentLink1URL: http://www.we-online.com; PackageVersion: 2005; Supplier: Newark; Supplier Part Number: 24AC5609; Manufacturer Part Number: 742792093; RoHS: Yes; Category: Ferrite Beads and Chips; Stock: 32000; Pricing: 1=0.145, 4000=0.145 (USD); Mounting Technology: Surface Mount; Case/Package: SMD/SMT; Case Code (Metric): 2012; Case Code (Imperial): 0805; Core Material: Ferrite; Weight: 0.000388oz; Min Operating Temperature: -55°C; Max Operating Temperature: 125°C; Package Quantity: 1; Packaging: Tape and Reel; Max Current Rating: 200mA; Max DC Current: 200mA; Termination: SMD/SMT; Series: WE-CBF; Length: 2mm; Width: 1.2mm; Height: 0.9mm; Depth: 1.2mm; RoHS Compliant: Yes; Reach SVHC Compliant: Unknown; Lead Free: Lead Free; ComponentLink3URL: https://datasheet.ciiva.com/1475/742792093-1475025.pdf?src-supplier=Farnell; ComponentLink3Description: https://datasheet.ciiva.com/1475/742792093-1475025.pdf?src-supplier=Farnell; ComponentLink4URL: https://datasheet.ciiva.com/1013/742792093-1013376.pdf?src-supplier=Digi-Key; ComponentLink4Description: https://datasheet.ciiva.com/1013/742792093-1013376.pdf?src-supplier=Digi-Key; ComponentLink5URL: https://datasheet.ciiva.com/4940/742792093-88569-4940476.pdf?src-supplier=Mouser; ComponentLink5Description: https://datasheet.ciiva.com/4940/742792093-88569-4940476.pdf?src-supplier=Mouser; ComponentLink6URL: https://datasheet.ciiva.com/11799/0900766b80bbd134-11799557.pdf?src-supplier=Rs; ComponentLink6Description: https://datasheet.ciiva.com/11799/0900766b80bbd134-11799557.pdf?src-supplier=Rs; ComponentLink7URL: https://datasheet.ciiva.com/14122/742792093-eng-tds-14122810.pdf?src-supplier=Distrelec; ComponentLink7Description: https://datasheet.ciiva.com/14122/742792093-eng-tds-14122810.pdf?src-supplier=Distrelec
R69 R70 = CMP-2001-00529-1: Manufacturer: Vishay; Manufacturer Part Number: CRCW080527R0FKEAHP; Tolerance: 1%; Max Power Dissipation: 500mW; Temperature Coefficient: 100ppm/°C; Power Rating: 330mW; Voltage Rating (DC): 150V; Supplier: Newark; Supplier Part Number: 95AC8908; RoHS: Yes; Category: Chip SMD Resistors; Stock: 20000; Pricing: 1=0.031, 5000=0.031 (USD); Case/Package: 0805; Case Code (Metric): 2012; Case Code (Imperial): 0805; Contact Plating: Tin; Min Operating Temperature: -55°C; Max Operating Temperature: 155°C; Series: CRCW-HP; Packaging: Cut Tape; Number of Terminations: 2; Package Quantity: 5000; Features: Automotive AEC-Q200; Voltage Rating: 150V; Termination: SMD/SMT; Resistor Type: Thick Film; Resistance Tolerance: 1%; Technology: THICK FILM; Length: 0.079inch; Width: 0.049inch; Height: 0.024inch; Depth: 1.25mm; Ratings: AEC-Q200; Radiation Hardening: No; RoHS Compliant: Yes; Lead Free: Lead Free; Reach SVHC Compliant: Unknown; ComponentLink1URL: https://datasheet.ciiva.com/7672/1885357-7672983.pdf?src-supplier=Element14; ComponentLink1Description: https://datasheet.ciiva.com/7672/1885357-7672983.pdf?src-supplier=Element14; ComponentLink2URL: https://datasheet.ciiva.com/2581/crcwhpe3-2581385.pdf?src-supplier=Digi-Key; ComponentLink2Description: https://datasheet.ciiva.com/2581/crcwhpe3-2581385.pdf?src-supplier=Digi-Key; ComponentLink3URL: https://datasheet.ciiva.com/7672/1885357-7672984.pdf?src-supplier=Element14; ComponentLink3Description: https://datasheet.ciiva.com/7672/1885357-7672984.pdf?src-supplier=Element14
U8 = CMP-0248-00015-2: USB to Full-Handshake UART Interface Chip, UHCI/OHCI/EHCI Compatible, USB 2.0 Compatible, -40 to +85 degC, 20-Pin SSOP, Pb-Free, Tube; Manufacturer: FTDI; Manufacturer Part Number: FT231XS-R; Interface: UART,USB; Number of Channels: 1; Max Supply Voltage: 5.5V; Min Supply Voltage: 2.97V; Operating Supply Voltage: 5V; Data Rate: 12Mbps; Operating Supply Current: 8mA; Supplier: Newark; Supplier Part Number: 83T7089; RoHS: Yes; Category: Interface ICs; Stock: 31663; Pricing: 1=3.09, 25=2.65, 100=2.58, 250=2.33 (USD); Mounting Technology: Surface Mount; Case/Package: SSOP; Pins: 20; Weight: 0.016oz; Min Operating Temperature: -40°C; Max Operating Temperature: 85°C; Packaging: Tape and Reel; Series: USBmadeEZ-UART, FT-X, X-Chip; Package Quantity: 1; Length: 8.74mm; Width: 0.157inch; Height: 0.059inch; Radiation Hardening: No; RoHS Compliant: Yes; ComponentLink1URL: https://datasheet.ciiva.com/30478/0900766b811020d3-30478147.pdf?src-supplier=Rs; ComponentLink1Description: https://datasheet.ciiva.com/30478/0900766b811020d3-30478147.pdf?src-supplier=Rs; ComponentLink2URL: https://datasheet.ciiva.com/1787/ft-x-series-1787028.pdf?src-supplier=Digi-Key; ComponentLink2Description: https://datasheet.ciiva.com/1787/ft-x-series-1787028.pdf?src-supplier=Digi-Key; ComponentLink3URL: https://datasheet.ciiva.com/1787/ft-x-series-1787029.pdf?src-supplier=Digi-Key; ComponentLink3Description: https://datasheet.ciiva.com/1787/ft-x-series-1787029.pdf?src-supplier=Digi-Key; ComponentLink4URL: https://datasheet.ciiva.com/1787/ft-x-series-1787030.pdf?src-supplier=Digi-Key; ComponentLink4Description: https://datasheet.ciiva.com/1787/ft-x-series-1787030.pdf?src-supplier=Digi-Key; ComponentLink5URL: https://datasheet.ciiva.com/48909/70403932-48909078.pdf?src-supplier=Allied+Electronics; ComponentLink5Description: https://datasheet.ciiva.com/48909/70403932-48909078.pdf?src-supplier=Allied+Electronics

## Nets that join several sheets
3.3V: 05_Buzz_Pump_LED_Temp_ICs (14 pins), 04_Brushed_Motor_ICs (R23.2 R27.2 U4.4 U5.4), 03_Power_ICs (8 pins), 02_Connectors (6 pins), 07_MCU (C10.1 C11.1 MD1.4), 08_Programming_Reset (P8.1 R63.2 R64.2 U7.5), 06_Servo_Motor_ICs (6 pins)
3.3V_REG: 03_Power_ICs (C308.1 U304.2 U304.4), 02_Connectors (P3.1)
3.3V_USB: 02_Connectors (P3.3), 09_USB_Bridge (C20.1 U8.3 U8.13 U8.14)
5.0V: 03_Power_ICs (5.0V.1 C307.1 U301.3 U304.3), 02_Connectors (P1.2), 06_Servo_Motor_ICs (C13.1 C15.2 C16.2 J7.2), 09_USB_Bridge (C21.1 C22.1 U8.15)
5.0V_REG: 03_Power_ICs (5 pins), 02_Connectors (P1.1)
5.0V_USB: 02_Connectors (P1.3), 09_USB_Bridge (L1.2)
GND: 05_Buzz_Pump_LED_Temp_ICs (12 pins), 04_Brushed_Motor_ICs (10 pins), 03_Power_ICs (28 pins), 02_Connectors (8 pins), 07_MCU (7 pins), 08_Programming_Reset (P8.2 R62.1 U7.2), 06_Servo_Motor_ICs (10 pins), 09_USB_Bridge (13 pins)
VBAT_POS: 05_Buzz_Pump_LED_Temp_ICs (D1.1 K1.2 K1.3), 04_Brushed_Motor_ICs (6 pins), 03_Power_ICs (Q300.2 R305.2 R?#1.1 VBAT_POS.1), 02_Connectors (P2.1)
3V3_PWR_GOOD: 03_Power_ICs (LED302.2 U303.1), 08_Programming_Reset (U7.1)
BUZZ_P9.0: 05_Buzz_Pump_LED_Temp_ICs (BUZZ.1 R11.1), 07_MCU (R31.2)
FTDI_RX_P6.5: 07_MCU (R59.1), 09_USB_Bridge (U8.4)
FTDI_TX_P6.4: 07_MCU (R58.1), 09_USB_Bridge (U8.20)
IN_A1_P9.4: 04_Brushed_Motor_ICs (IN_A1.1 R21.2), 07_MCU (R35.2)
IN_A2_P9.6: 04_Brushed_Motor_ICs (IN_A2.1 R20.2), 07_MCU (R39.2)
IN_B1_P10.4: 04_Brushed_Motor_ICs (IN_B2.1 R25.2), 07_MCU (R49.2)
IN_B2_P10.6: 04_Brushed_Motor_ICs (IN_B1.1 R24.2), 07_MCU (R53.2)
INT_P5.2: 05_Buzz_Pump_LED_Temp_ICs (R5.1), 07_MCU (R44.1)
LED_EN0_P10.2: 02_Connectors (J6.2), 07_MCU (R45.2)
LED_EN1_P10.3: 02_Connectors (J6.3), 07_MCU (R47.2)
OTS_P5.3: 05_Buzz_Pump_LED_Temp_ICs (R17.1 U3.3), 07_MCU (R46.1)
OUT_A1: 04_Brushed_Motor_ICs (U4.6), 02_Connectors (J4.1)
OUT_A2: 04_Brushed_Motor_ICs (U4.8), 02_Connectors (J4.2)
OUT_B1: 04_Brushed_Motor_ICs (U5.6), 02_Connectors (J5.1)
OUT_B2: 04_Brushed_Motor_ICs (U5.8), 02_Connectors (J5.2)
PROX_OUT0: 05_Buzz_Pump_LED_Temp_ICs (PROX_OUT0.1 U1.9), 02_Connectors (P4.1)
PROX_OUT1: 05_Buzz_Pump_LED_Temp_ICs (PROX_OUT1.1 U1.10), 02_Connectors (P5.1)
PROX_OUT2: 05_Buzz_Pump_LED_Temp_ICs (PROX_OUT2.1 U1.11), 02_Connectors (P6.1)
PROX_OUT3: 05_Buzz_Pump_LED_Temp_ICs (PROX_OUT3.1 U1.12), 02_Connectors (P7.1)
SCL_P5.0: 05_Buzz_Pump_LED_Temp_ICs (R6.1 R13.1 U3.2), 07_MCU (R40.1)
SDA_P5.1: 05_Buzz_Pump_LED_Temp_ICs (R7.1 R14.1 U3.1), 07_MCU (R42.1)
SERVO_P9.2: 07_MCU (R33.2), 06_Servo_Motor_ICs (R67.1)
SWDCLK_P6.7: 07_MCU (R61.1), 08_Programming_Reset (P8.4)
SWDIO_P6.6: 07_MCU (R60.1), 08_Programming_Reset (P8.5)
USR_LED1_P5.5: 07_MCU (R50.1), 08_Programming_Reset (LED1.2)
XRES_N: 07_MCU (MD1.42 XRES_N.1), 08_Programming_Reset (LED2.1 U7.4)